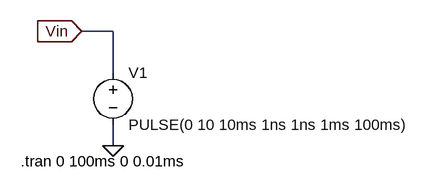
[diagram p0: schematic signal.asc]
signal.asc, the LTspice schematic file:
Version 4
SHEET 1 880 680
WIRE 48 32 0 32
WIRE 48 96 48 32
WIRE 48 208 48 176
FLAG 48 208 0
FLAG 0 32 Vin
IOPIN 0 32 In
SYMBOL voltage 48 80 R0
WINDOW 123 0 0 Left 0
WINDOW 39 0 0 Left 0
SYMATTR InstName V1
SYMATTR Value PULSE(0 10 10ms 1ns 1ns 1ms 100ms)
TEXT -94 232 Left 2 !.tran 0 100ms 0 0.01ms

The netlist it stands for:
* signal.asc
V1 Vin 0 PULSE(0 10 10ms 1ns 1ns 1ms 100ms)
.tran 0 100ms 0 0.01ms
.backanno
.end